# EAGLE design v5m (EAGLE 6.2)
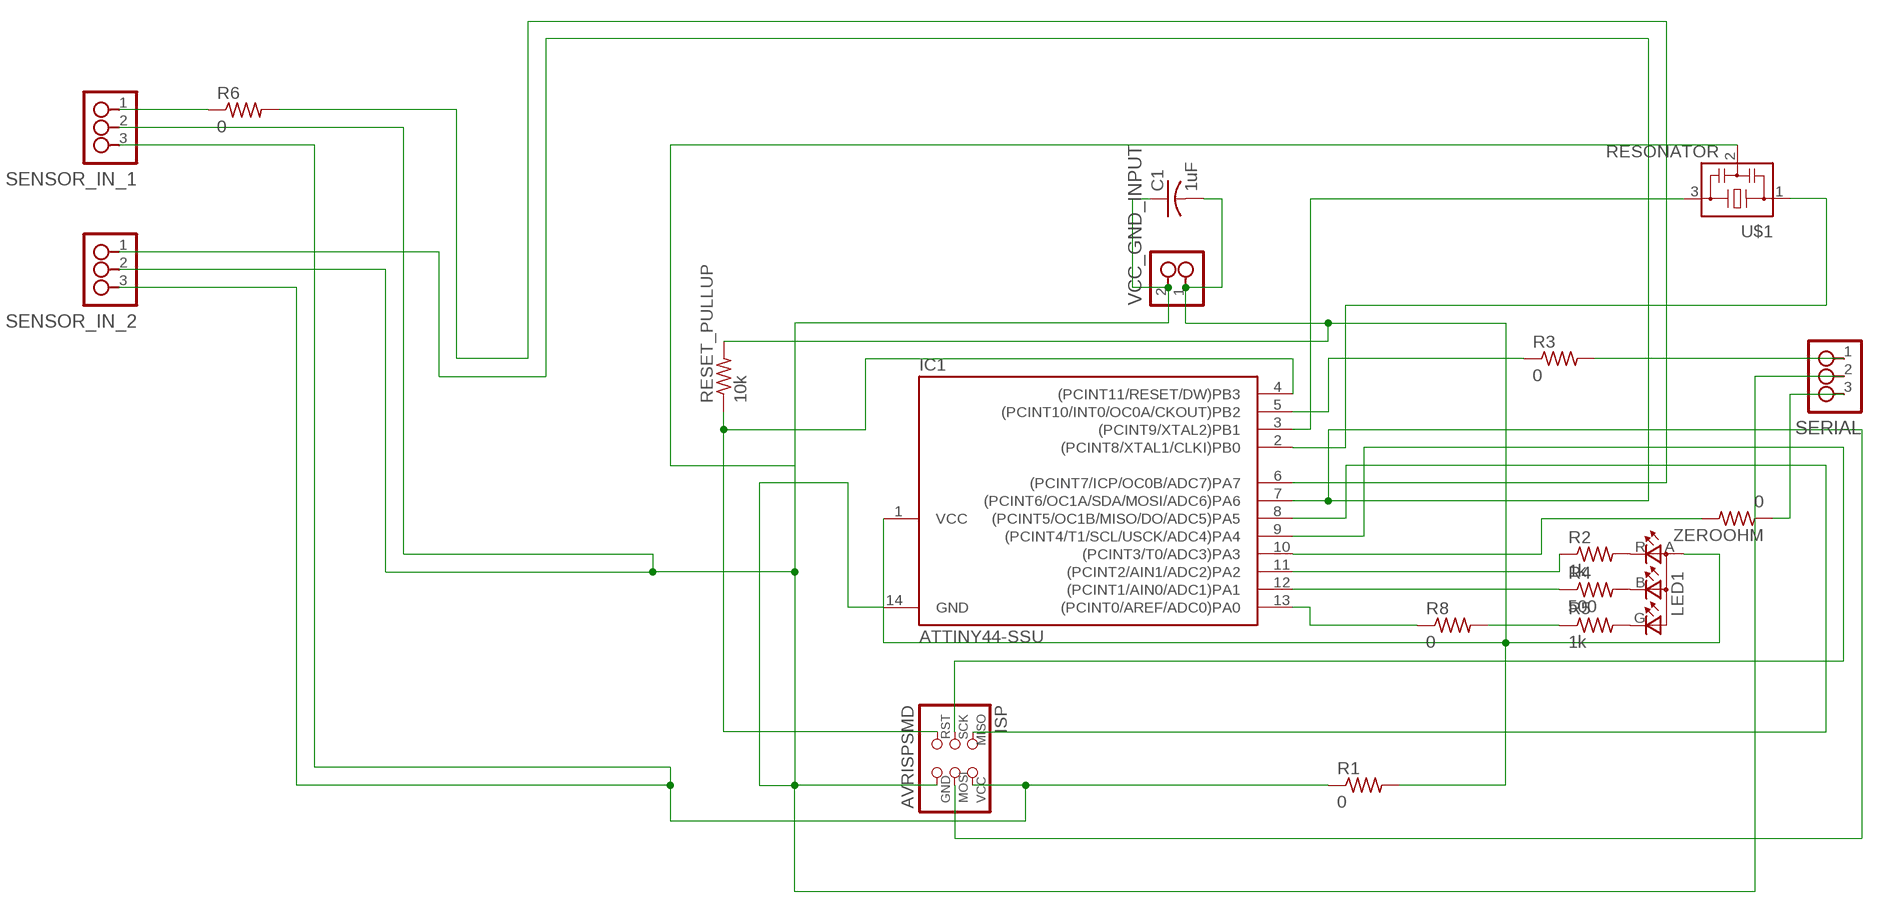
[diagram p0: schematic, sheet 1]

## Parts
C1  1uF  C-USC1206  [C1206]
IC1  ATTINY44-SSU  [SOIC14]
ISP  AVRISPSMD  [2X03SMD]
LED1  LEDRGBOLD  [P-LCC-4-3]
R1  0  RES-US1206  [R1206]
R2  1k  RES-US1206  [R1206]
R3  0  RES-US1206  [R1206]
R4  500  RES-US1206  [R1206]
R5  1k  RES-US1206  [R1206]
R6  0  RES-US1206  [R1206]
R8  0  RES-US1206  [R1206]
RESET_PULLUP  10k  R-US_R1206  [R1206]
SENSOR_IN_1  3_PIN_HEADERHEADER  [SMT_PINS_3]
SENSOR_IN_2  3_PIN_HEADERHEADER  [SMT_PINS_3]
SERIAL  3_PIN_HEADERHEADER  [SMT_PINS_3]
U$1  RESONATOR  [EFOBM]
VCC_GND_INPUT  2_PIN_HEADERHEADER  [SMT_PINS_2]
ZEROOHM  0  R-US_R1206  [R1206]

## Nets
ATTINY45: IC1.9((PCINT4/T1/SCL/USCK/ADC4)PA4) ISP.3(SCK)
N$2: C1.2 IC1.1(VCC) LED1.A(A2) R1.2 RESET_PULLUP.2 VCC_GND_INPUT.1
N$3: R5.1 R8.2
N$4: IC1.8((PCINT5/OC1B/MISO/DO/ADC5)PA5) ISP.1(MISO)
N$5: IC1.4((PCINT11/RESET/DW)PB3) ISP.5(RST) RESET_PULLUP.1
N$6: IC1.5((PCINT10/INT0/OC0A/CKOUT)PB2) R3.1
N$7: IC1.2((PCINT8/XTAL1/CLKI)PB0) U$1.1
N$8: ISP.2(VCC) R1.1 SENSOR_IN_1.3 SENSOR_IN_2.3
N$9: R6.1 SENSOR_IN_1.1
N$10: LED1.R(CRED) R2.2
N$11: LED1.B(CBLUE) R4.2
N$12: IC1.6((PCINT7/ICP/OC0B/ADC7)PA7) R6.2
N$13: IC1.3((PCINT9/XTAL2)PB1) U$1.3
N$14: LED1.G(CGREEN) R5.2
N$15: IC1.13((PCINT0/AREF/ADC0)PA0) R8.1
N$16: C1.1 IC1.14(GND) ISP.6(GND) SENSOR_IN_1.2 SENSOR_IN_2.2 SERIAL.2 U$1.2 VCC_GND_INPUT.2
N$17: IC1.11((PCINT2/AIN1/ADC2)PA2) R2.1
N$18: IC1.12((PCINT1/AIN0/ADC1)PA1) R4.1
N$19: R3.2 SERIAL.1
N$20: IC1.10((PCINT3/T0/ADC3)PA3) ZEROOHM.2
N$21: IC1.7((PCINT6/OC1A/SDA/MOSI/ADC6)PA6) ISP.4(MOSI) SENSOR_IN_2.1
N$22: SERIAL.3 ZEROOHM.1

## Library data of the parts
C1 = resistor:C-US: CAPACITOR, American symbol
IC1 = fab:ATTINY44
ISP = fab:AVRISP
LED1 = fab:LEDRGBOLD: OSRAM Hyper Multi TOPLED® Hyper-Bright LED LATB T686 Source: http://www.osram.convergy.de/
R1-R6 R8 = fab:RES-US: Resistor (US Symbol) Variants with postfix FAB are widened to allow the routing of internal traces
RESET_PULLUP ZEROOHM = resistor:R-US_: RESISTOR, American symbol
SENSOR_IN_1 SENSOR_IN_2 SERIAL = ng:3_PIN_HEADER: 3 SMT pin pads
U$1 = fab:RESONATOR
VCC_GND_INPUT = ng:2_PIN_HEADER: 2 SMT pin pads

## Net classes
0 default: width 0.305 mm

## Board
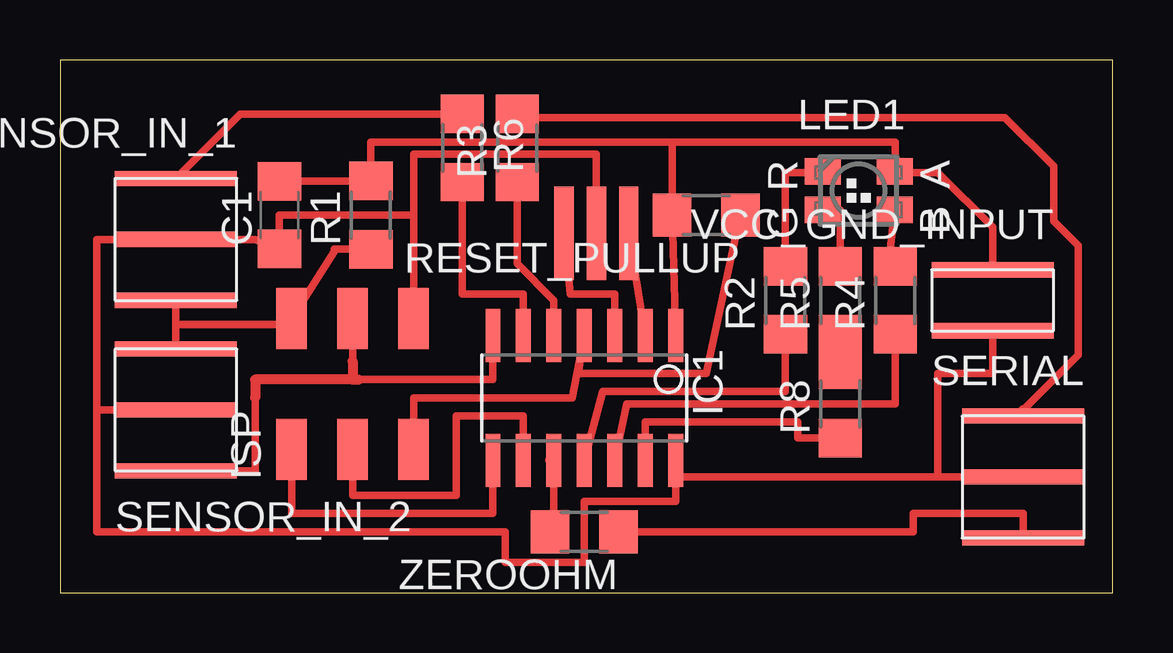
[diagram p1: board, top side]

Size 43.87 x 22.21 mm. Coordinates in mm from the lower left corner, seen from the top.
Outline: 0,0 43.87,0 43.87,22.21 0,22.21 0,0
Copper layers (1*16): Top 0.035mm / dielectric 1.5mm / Bottom 0.035mm
Design rules: minimum track width 10mil, minimum drill 24mil, track to track 8mil, track to pad 8mil, pad to pad 8mil, via to via 8mil, smd to smd 8mil, copper to edge 40mil, drill to drill 8mil, minimum pad ring 10mil, minimum via ring 8mil, stop-mask expansion 4mil, vias tented up to drill 0mil, thermal gap 10mil

### Footprints (pad centres in the part's own frame; a part is rotated, then mirrored left to right if it is on the bottom)
C1206 = smd 1.6 x 1.8: 1 -1.4,0; 2 1.4,0
SOIC14 = smd 0.61 x 2.21: 1 -3.81,-2.603; 2 -2.54,-2.603; 3 -1.27,-2.603; 4 0,-2.603; 5 1.27,-2.603; 6 2.54,-2.603; 7 3.81,-2.603; 8 3.81,2.603; 9 2.54,2.603; 10 1.27,2.603; 11 0,2.603; 12 -1.27,2.603; 13 -2.54,2.603; 14 -3.81,2.603
2X03SMD = smd 2.54 x 1.27: 1 -2.54,2.54; 2 2.92,2.54; 3 -2.54,0; 4 2.92,0; 5 -2.54,-2.54; 6 2.92,-2.54
P-LCC-4-3 = smd 1.1 x 1.5: A -0.8,1.5; B 0.8,1.5; G 0.8,-1.5; R -0.8,-1.5
R1206 = smd 1.6 x 1.803: 1 -1.422,0; 2 1.422,0
SMT_PINS_3 = smd 5.08 x 0.635: 1 0,0; 2 0,2.54; 3 0,5.08
EFOBM = smd 0.8 x 3.9: 1 -1.35,0; 2 0,0; 3 1.35,0
SMT_PINS_2 = smd 5.08 x 0.635: 1 0,0; 2 0,2.54

### Placement (x,y rotation side)
C1  9.14,15.75 90 top
IC1  21.84,8.13 180 top
ISP  12.19,8.51 90 top
LED1  33.27,16.76 270 top
R1  12.95,15.75 90 top
R2  30.23,12.19 90 top
R3  19.05,18.54 90 top
R4  34.8,12.19 90 top
R5  32.51,12.19 90 top
R6  16.76,18.54 270 top
R8  32.51,7.87 90 top
RESET_PULLUP  26.92,15.75 180 top
SENSOR_IN_1  4.83,17.27 180 top
SENSOR_IN_2  4.83,5.08 0 top
SERIAL  40.13,7.37 180 top
U$1  22.35,14.99 180 top
VCC_GND_INPUT  38.86,13.46 180 top
ZEROOHM  21.84,2.54 180 top

### Tracks (layer width: path | path; a pad name or v marks a point on that pad's centre or on a via)
ATTINY45
  Top 0.305: IC1.9 19.3,7.37 16.51,7.37 16.51,4.06 12.19,4.06 ISP.3
N$2
  Top 0.305: IC1.1 RESET_PULLUP.2 25.5,18.8 | 25.5,18.8 34.8,18.8 34.8,17.56 LED1.A 34.81,17.53 36.58,17.53 38.86,15.24 VCC_GND_INPUT.1 | 25.5,18.8 12.95,18.8 R1.2 9.14,17.17 C1.2
N$3
  Top 0.254: R5.1 R8.2
N$4
  Top 0.305: IC1.8 18.03,3.3 9.65,3.3 ISP.1
N$5
  Top 0.305: ISP.5 14.73,8.13 21.34,8.13 IC1.4 21.59,9.14 26.92,9.14 RESET_PULLUP.1
N$6
  Top 0.305: IC1.5 20.57,12.19 19.05,13.72 R3.1
N$7
  Top 0.305: U$1.1 IC1.2
N$8
  Top 0.305: SENSOR_IN_2.3 4.83,11.18 | SENSOR_IN_1.3 4.83,11.18 | 4.83,11.18 9.14,11.18 ISP.2 11.43,14.22 11.43,14.33 R1.1
N$9
  Top 0.305: R6.1 7.52,19.96 SENSOR_IN_1.1
N$10
  Top 0.305: LED1.R 31.77,17.53 30.23,17.53 R2.2
N$11
  Top 0.305: LED1.B 34.52,13.61 R4.2
N$12
  Top 0.305: R6.2 16.76,12.45 19.3,12.45 IC1.6
N$13
  Top 0.305: U$1.3 21.26,12.45 23.11,12.45 IC1.3
N$14
  Top 0.305: R5.2 32.51,15.96 LED1.G
N$15
  Top 0.305: IC1.13 24.38,7.11 30.73,7.11 30.73,6.45 R8.1
N$16
  Top 0.305: 1.52,7.62 1.52,14.73 SENSOR_IN_1.2 8.13,14.73 C1.1 9.14,15.75 14.73,15.75 | 1.52,7.62 SENSOR_IN_2.2 | IC1.14 25.65,4.83 | 25.65,4.83 36.58,4.83 | ISP.6 14.73,15.75 | U$1.2 22.35,18.29 14.73,18.29 14.73,15.75 | 1.52,7.62 1.52,2.54 18.54,2.54 18.54,1.27 21.84,1.27 21.84,3.81 25.65,3.81 25.65,4.83 | SERIAL.2 36.58,4.83 | VCC_GND_INPUT.2 38.86,9.14 36.58,9.14 36.58,4.83
N$17
  Top 0.305: IC1.11 22.61,8.38 30.23,8.38 R2.1
N$18
  Top 0.305: R4.1 34.8,7.87 23.62,7.87 IC1.12
N$19
  Top 0.305: 19.2,19.81 39.37,19.81 41.4,17.78 41.4,15.49 42.42,14.48 42.42,9.91 40.13,7.62
  Top 0.406: R3.2 19.2,19.81 | 40.13,7.62 SERIAL.1
N$20
  Top 0.305: IC1.10 20.57,3.3 20.42,3.3 ZEROOHM.2
  Top 0.406: IC1.10 20.42,5.53
N$21
  Top 0.305: 8.13,8.13 8.13,5.08 SENSOR_IN_2.1 | ISP.4 12.19,9.65 | IC1.7 18.03,8.89 12.45,8.89
  Top 0.406: 12.19,9.65 12.19,8.89 | 12.19,8.89 12.45,8.89 | 12.19,8.89 8.13,8.89 8.13,8.13
N$22
  Top 0.305: ZEROOHM.1 35.56,2.54 35.56,3.3 40.13,3.3 SERIAL.3
  Top 0.406: ZEROOHM.1 23.27,2.29